# Altium schematic sheet DAC_PLL.SchDoc: RFSoC AMC
size 420 x 297 mm; CompanyName: WUT; DrawnBy: T. Przywozki; Organization: WUT ISE; Address1: Warsaw University of Technology; Address2: Nowowiejska 15/19 00-665 Warsaw; Address3: Tomasz.Przywozki@pw.edu.pl; DocumentNumber: 20; Revision: 1; SheetNumber: 20; SheetTotal: 45; Project: RFSoC AMC; ModifiedBy: T. Przywozki; CreateDate: -; CheckedDate: -; DivGrp: ISE; Designer: T. Przywozki; ModifiedDate: -; ProjectName: ADC/DAC MEZZANINE
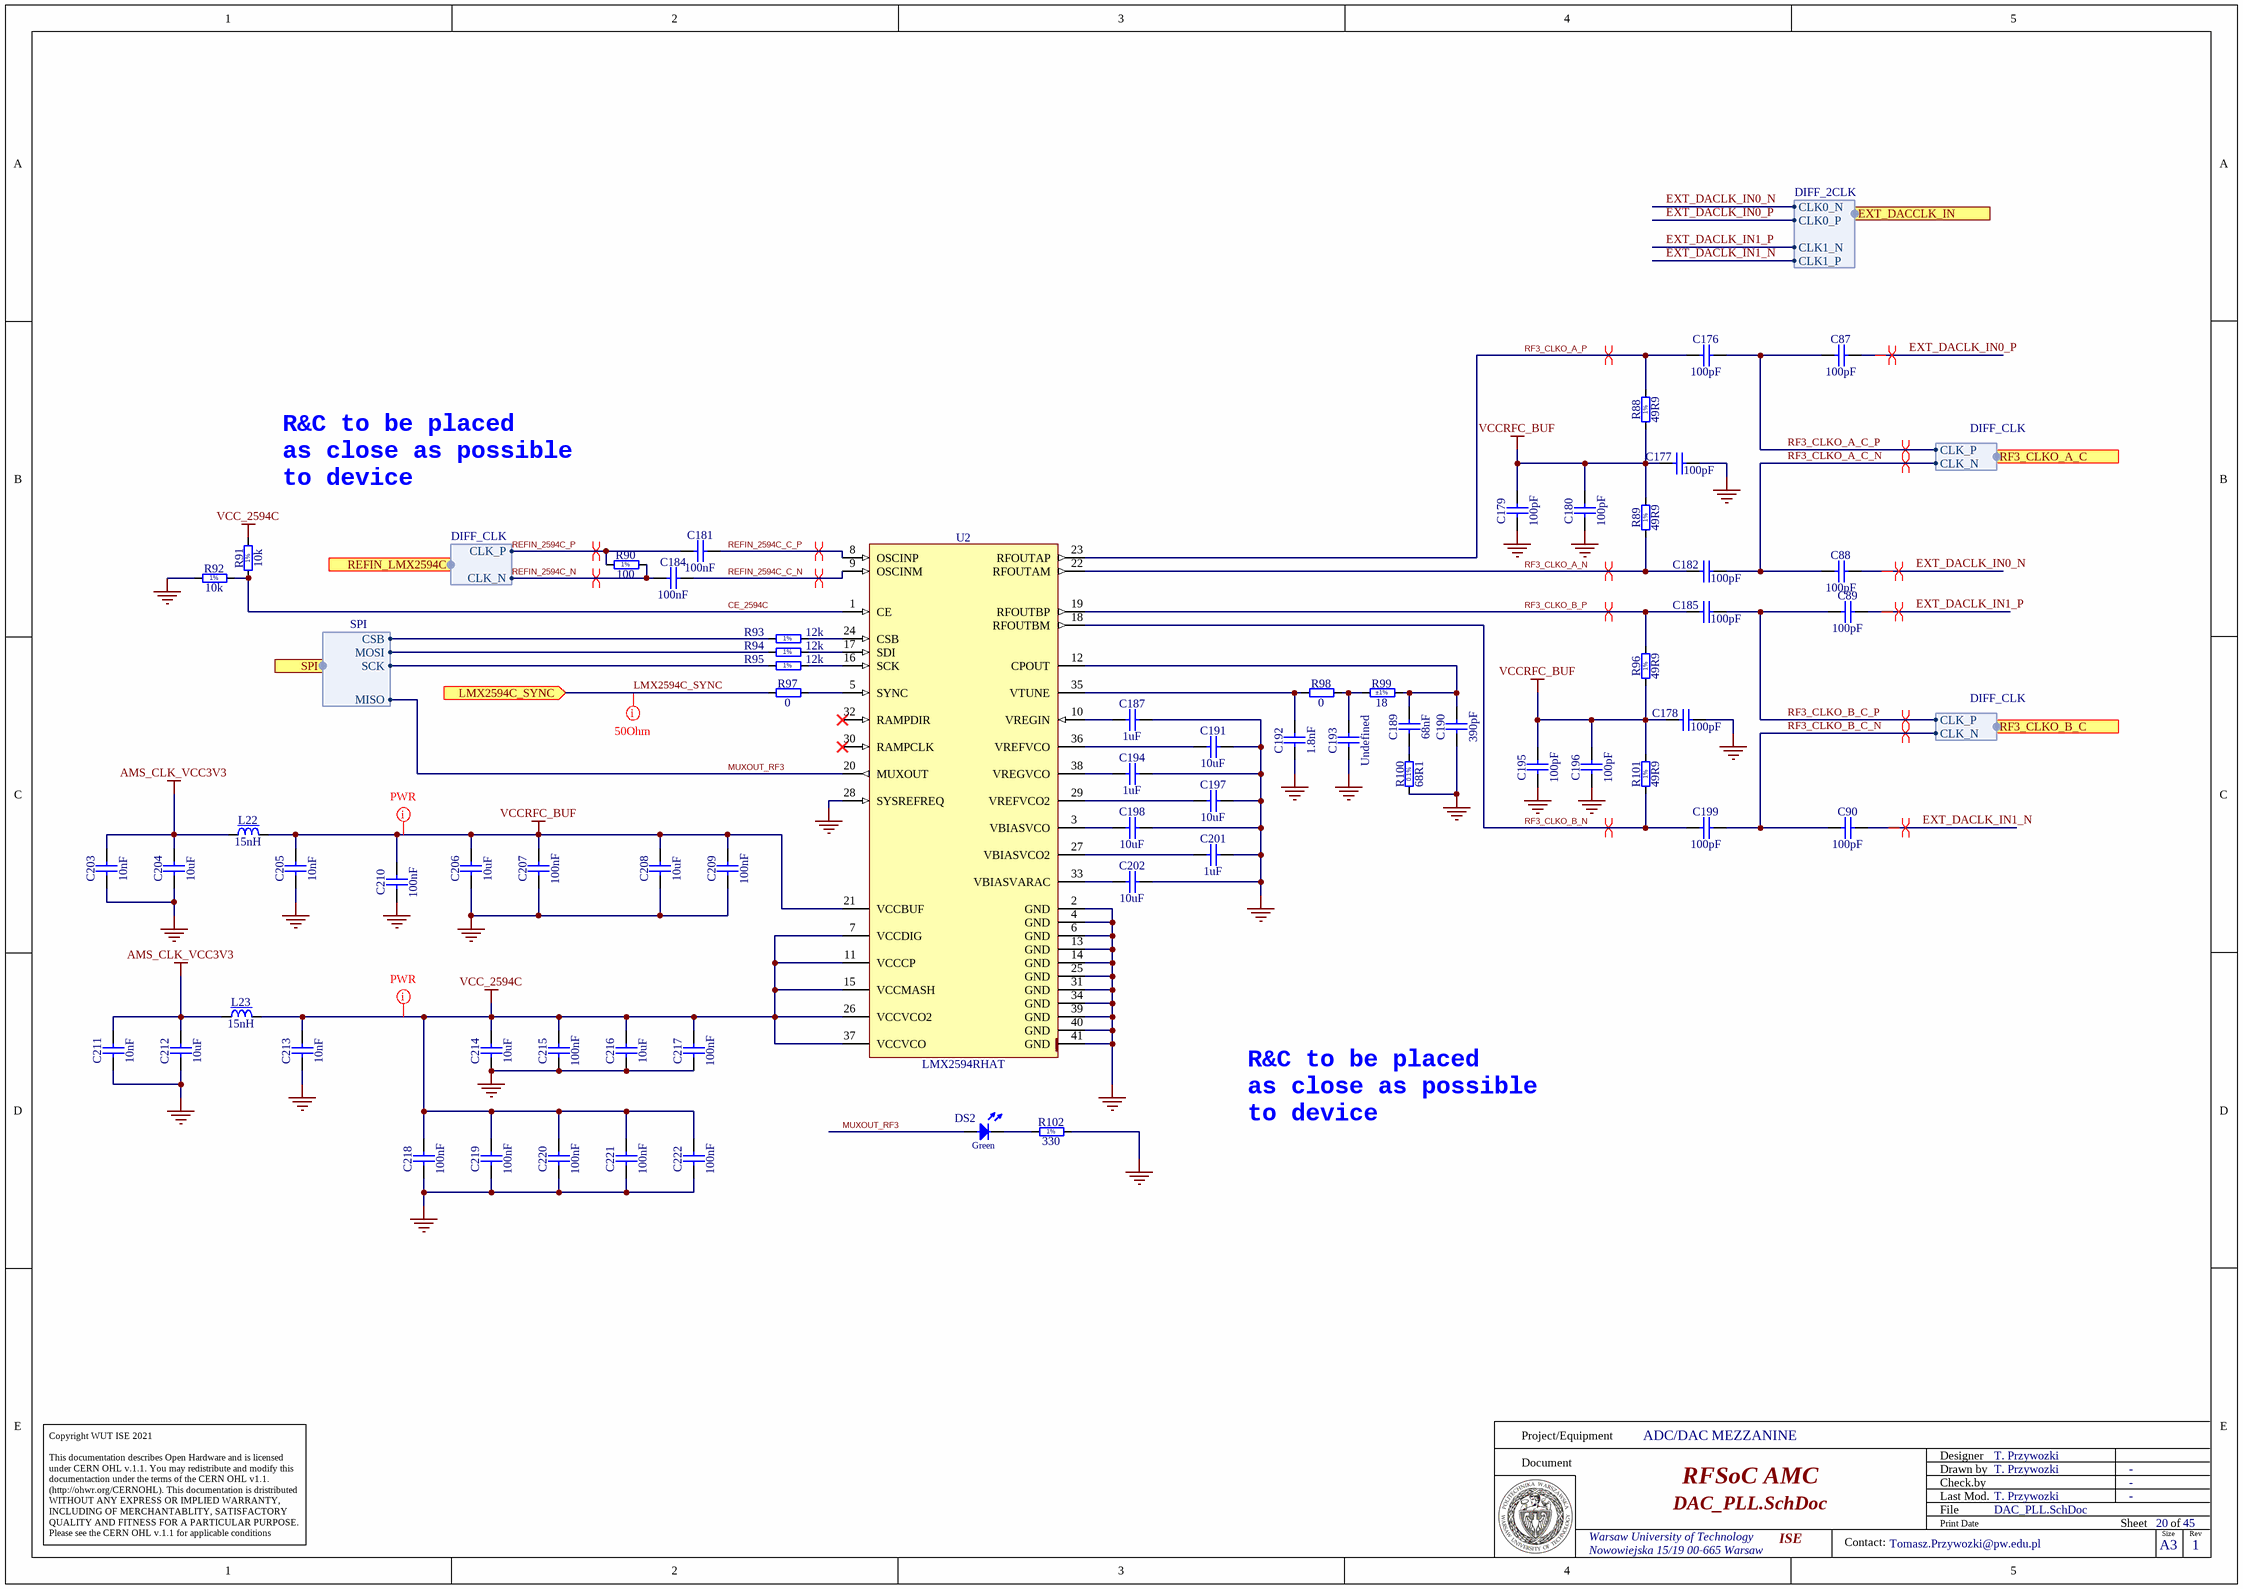
[diagram p0: DAC_PLL.SchDoc]

## Parts
C87  100pF  [CAPC1005X55N]
C88  100pF  [CAPC1005X55N]
C89  100pF  [CAPC1005X55N]
C90  100pF  [CAPC1005X55N]
C176  100pF  [CAPC1005X55N]
C177  100pF  [CAPC1005X55N]
C178  100pF  [CAPC1005X55N]
C179  100pF  [CAPC1005X55N]
C180  100pF  [CAPC1005X55N]
C181  100nF  [CAPC1005X55N]
C182  100pF  [CAPC1005X55N]
C184  100nF  [CAPC1005X55N]
C185  100pF  [CAPC1005X55N]
C187  1uF  [CAPC1005X55N]
C189  68nF  [CAPC1005X55N]
C190  390pF  [CAPC1608X87N]
C191  10uF  [CAPC1608X80N]
C192  1.8nF  [CAPC1608X87N]
C193  Undefined  [CAPC1005X55N]
C194  1uF  [CAPC1005X55N]
C195  100pF  [CAPC1005X55N]
C196  100pF  [CAPC1005X55N]
C197  10uF  [CAPC1608X80N]
C198  10uF  [CAPC1608X80N]
C199  100pF  [CAPC1005X55N]
C201  1uF  [CAPC1005X55N]
C202  10uF  [CAPC1608X80N]
C203  10nF  [CAPC1005X55N]
C204  10uF  [CAPC1608X80N]
C205  10nF  [CAPC1005X55N]
C206  10uF  [CAPC1608X80N]
C207  100nF  [CAPC1005X55N]
C208  10uF  [CAPC1608X80N]
C209  100nF  [CAPC1005X55N]
C210  100nF  [CAPC1005X55N]
C211  10nF  [CAPC1005X55N]
C212  10uF  [CAPC1608X80N]
C213  10nF  [CAPC1005X55N]
C214  10uF  [CAPC1608X80N]
C215  100nF  [CAPC1005X55N]
C216  10uF  [CAPC1608X80N]
C217  100nF  [CAPC1005X55N]
C218  100nF  [CAPC1005X55N]
C219  100nF  [CAPC1005X55N]
C220  100nF  [CAPC1005X55N]
C221  100nF  [CAPC1005X55N]
C222  100nF  [CAPC1005X55N]
DS2  Green  [LED_OSRAM_LGL29K]
L22  15nH  [IND_COILCRAFT_0402DC]
L23  15nH  [IND_COILCRAFT_0402DC]
R88  49R9  [RESC1005X40N]
R89  49R9  [RESC1005X40N]
R90  100  [RESC1005X40N]
R91  10k  [RESC1005X40N]
R92  10k  [RESC1005X40N]
R93  12k  [RESC1005X40N]
R94  12k  [RESC1005X40N]
R95  12k  [RESC1005X40N]
R96  49R9  [RESC1005X40N]
R97  0  [RESC1005X40N]
R98  0  [RESC1005X40N]
R99  18  Tolerance: ±1%  [RESC1005X40N]
R100  68R1  [RESC1608X55N]
R101  49R9  [RESC1005X40N]
R102  330  [RESC1005X40N]
U2  LMX2594RHAT  [QFN50P600X600X100-41N-S460]

## Ports
EXT_DACCLK_IN (harness DIFF_2CLK), LMX2594C_SYNC (in), REFIN_LMX2594C (harness DIFF_CLK), RF3_CLKO_A_C (harness DIFF_CLK), RF3_CLKO_B_C (harness DIFF_CLK), SPI (harness SPI)

## Harnesses
DIFF_CLK: CLK_P, CLK_N
SPI: MOSI, MISO, CSB, SCK
DIFF_2CLK: CLK0_P, CLK0_N, CLK1_P, CLK1_N

## Nets
AMS_CLK_VCC3V3: C203.2 C204.2 C211.2 C212.2 L22.1 L23.1
GND: C177.2 C178.2 C179.1 C180.1 C187.1 C190.1 C191.1 C192.1 C193.1 C194.1 C195.1 C196.1 C197.1 C198.1 C201.1 C202.1 C203.1 C204.1 C205.1 C206.1 C207.1 C208.1 C209.1 C210.1 C211.1 C212.1 C213.1 C214.1 C215.1 C216.1 C217.1 C218.1 C219.1 C220.1 C221.1 C222.1 R92.1 R100.1 R102.2 U2.2(GND) U2.4(GND) U2.6(GND) U2.13(GND) U2.14(GND) U2.25(GND) U2.28(SYSREFREQ) U2.31(GND) U2.34(GND) U2.39(GND) U2.40(GND) U2.41(GND)
VCC_2594C: C213.2 C214.2 C215.2 C216.2 C217.2 C218.2 C219.2 C220.2 C221.2 C222.2 L23.2 R91.2 U2.7(VCCDIG) U2.11(VCCCP) U2.15(VCCMASH) U2.26(VCCVCO2) U2.37(VCCVCO)
VCCRFC_BUF: C177.1 C178.1 C179.2 C180.2 C195.2 C196.2 C205.2 C206.2 C207.2 C208.2 C209.2 C210.2 L22.2 R88.1 R89.2 R96.1 R101.2 U2.21(VCCBUF)
CE_2594C: R91.1 R92.2 U2.1(CE)
EXT_DACLK_IN0_N: C88.2 ; port EXT_DACCLK_IN.CLK0_N
EXT_DACLK_IN0_P: C87.2 ; port EXT_DACCLK_IN.CLK0_P
EXT_DACLK_IN1_N: C90.2 ; port EXT_DACCLK_IN.CLK1_P
EXT_DACLK_IN1_P: C89.2 ; port EXT_DACCLK_IN.CLK1_N
LMX2594C_SYNC: R97.1 ; port LMX2594C_SYNC
MUXOUT_RF3: DS2.2(A) U2.20(MUXOUT) ; port SPI.MISO
REFIN_2594C_C_N: C184.2 U2.9(OSCINM)
REFIN_2594C_C_P: C181.2 U2.8(OSCINP)
REFIN_2594C_N: C184.1 R90.2 ; port REFIN_LMX2594C.CLK_N
REFIN_2594C_P: C181.1 R90.1 ; port REFIN_LMX2594C.CLK_P
RF3_CLKO_A_C_N: C88.1 C182.2 ; port RF3_CLKO_A_C.CLK_N
RF3_CLKO_A_C_P: C87.1 C176.2 ; port RF3_CLKO_A_C.CLK_P
RF3_CLKO_A_N: C182.1 R89.1 U2.22(RFOUTAM)
RF3_CLKO_A_P: C176.1 R88.2 U2.23(RFOUTAP)
RF3_CLKO_B_C_N: C90.1 C199.2 ; port RF3_CLKO_B_C.CLK_N
RF3_CLKO_B_C_P: C89.1 C185.2 ; port RF3_CLKO_B_C.CLK_P
RF3_CLKO_B_N: C199.1 R101.1 U2.18(RFOUTBM)
RF3_CLKO_B_P: C185.1 R96.2 U2.19(RFOUTBP)
NetC187_2: C187.2 U2.10(VREGIN)
NetC189_1: C189.1 R100.2
NetC189_2: C189.2 C190.2 R99.2 U2.12(CPOUT)
NetC191_2: C191.2 U2.36(VREFVCO)
NetC192_2: C192.2 R98.1 U2.35(VTUNE)
NetC193_2: C193.2 R98.2 R99.1
NetC194_2: C194.2 U2.38(VREGVCO)
NetC197_2: C197.2 U2.29(VREFVCO2)
NetC198_2: C198.2 U2.3(VBIASVCO)
NetC201_2: C201.2 U2.27(VBIASVCO2)
NetC202_2: C202.2 U2.33(VBIASVARAC)
NetDS2_1: DS2.1(C) R102.1
NetR93_1: R93.1 U2.24(CSB)
NetR93_2: R93.2 ; port SPI.CSB
NetR94_1: R94.1 U2.17(SDI)
NetR94_2: R94.2 ; port SPI.MOSI
NetR95_1: R95.1 U2.16(SCK)
NetR95_2: R95.2 ; port SPI.SCK
NetR97_2: R97.2 U2.5(SYNC)

Not connected (* = marked no-connect by the designer): U2 30(RAMPCLK)* 32(RAMPDIR)*

## Layout directives
differential pair; differential pair class Diff_100Ohm: EXT_DACLK_IN0_N, EXT_DACLK_IN0_P, EXT_DACLK_IN1_N, EXT_DACLK_IN1_P, REFIN_2594C_C_N, REFIN_2594C_C_P, REFIN_2594C_N, REFIN_2594C_P, RF3_CLKO_A_C_N, RF3_CLKO_A_C_P, RF3_CLKO_A_N, RF3_CLKO_A_P, RF3_CLKO_B_C_N, RF3_CLKO_B_C_P, RF3_CLKO_B_N, RF3_CLKO_B_P
mark named 50Ohm: LMX2594C_SYNC
net class PWR: VCC_2594C, VCCRFC_BUF

## Notes on the sheet
- R&C to be placed
  as close as possible
  to device
- Project/Equipment
- Document
- Designer
- Drawn by
- Check.by
- Copyright WUT ISE 2021
  This documentation describes Open Hardware and is licensed under CERN OHL v.1.1. You may redistribute and modify this documentaction under the terms of the CERN OHL v1.1.
  (http://ohwr.org/CERNOHL). This documentation is dristributed WITHOUT ANY EXPRESS OR IMPLIED WARRANTY, INCLUDING OF MERCHANTABLITY, SATISFACTORY QUALITY AND FITNESS FOR A PARTICULAR PURPOSE. Please see the CERN OHL v.1.1 for applicable conditions
- File
- Last Mod.
- Print Date
- Sheet
- Size
- A3
- of
- Rev
- Contact:
- (in symbol R0402_10K_1%_0.0625W_100PPM) 1%
- (in symbol R0402_12K_1%_0.0625W_100PPM) 1%
- (in symbol R0402_49R9_1%_0.0625W_100PPM) 1%
- (in symbol R0402_100R_1%_0.1W_100PPM) 1%
- (in symbol R0402_330R_1%_0.0625W_100PPM) 1%
- (in symbol R0603_68R1_0.1%_0.063W_10PPM) 0.1%

## Library data of the parts
C87-C90 C176-C180 C182 C185 C195 C196 C199 = CC0402_100PF_25V_5%_C0G_KEMET_HiQ-CBR: Non-polarised capacitor; Part Description: High Q and low ESR, SMD Multilayer Chip Ceramic Capacitor, HiQ-CBR Series; Manufacturer: KEMET; Manufacturer Part Number: CBR04C101J3GAC; Voltage: 25V; TC: C0G/NP0; Tolerance: ±5%; Part Number: CC0402_100PF_25V_5%_C0G_KEMET_HiQ-CBR; Component Kind: Standard; Component Type: Standard; Pin Count: 2; Value: 100pF; Status: Not Recommended; Case: 0402; Mounted: Yes; Socket: No; SMD: Yes; Sense: No; ComponentHeight: 0.55mm; HelpURL: \\cern.ch\dfs\Applications\Altium\Datasheets\CC0402_C0G_KEMET_HiQ-CBR.pdf; Author: CERN DEM MR; CreateDate: 17.11.2017; LatestRevisionDate: 21.11.2017
C181 C184 C207 C209 C210 C215 C217-C222 = CC0402_100NF_25V_10%_X7R_YUDEN_TMK105B7104KVHF: Non-polarised capacitor; Part Description: SMD Multilayer Chip Ceramic Capacitor (High Dielectric Type) for Automotive / Industrial Applications; Manufacturer: TAIYO YUDEN; Voltage: 25V; TC: X7R; Tolerance: ±10%; Part Number: CC0402_100NF_25V_10%_X7R_YUDEN_TMK105B7104KVHF; Component Kind: Standard; Component Type: Standard; Pin Count: 2; Value: 100nF; Status: Not Recommended; Manufacturer Part Number: TMK105B7104KVHF; Case: 0402; Mounted: Yes; Socket: No; SMD: Yes; Sense: No; ComponentHeight: 0.55mm; HelpURL: \\cern.ch\dfs\Applications\Altium\Datasheets\CC0402_TAIYO-YUDEN_TMK105B7104KVHF.pdf; Author: CERN DEM JLC; CreateDate: 10.05.2017; LatestRevisionDate: 10.05.2017
C187 C194 C201 = CC0402_1UF_16V_10%_X5R: Non-polarised capacitor; Part Description: SMD Multilayer Chip Ceramic Capacitor; Manufacturer: GENERIC; Manufacturer1 Part Number: C1005X5R1C105KT; Voltage: 16V; TC: X5R; Tolerance: ±10%; Part Number: CC0402_1UF_16V_10%_X5R; Component Kind: Standard; Component Type: Standard; Pin Count: 2; Value: 1uF; Status: Preferred; Manufacturer Part Number: CC0402_1UF_16V_10%_X5R; Case: 0402; Mounted: Yes; Socket: No; SMD: Yes; Sense: No; Manufacturer1 Example: TDK; Manufacturer1 ComponentHeight: 0.55mm; HelpURL: \\cern.ch\dfs\Applications\Altium\Datasheets\CC0402_X5R_TDK_C.pdf; Author: CERN DEM JLC; CreateDate: 25.10.2012; LatestRevisionDate: 25.10.2012
C189 = CC0402_68NF_16V_10%_X7R: Non-polarised capacitor; Part Description: SMD Multilayer Chip Ceramic Capacitor; Manufacturer: GENERIC; Manufacturer1 Part Number: 223878715647; Voltage: 16V; TC: X7R; Tolerance: ±10%; Part Number: CC0402_68NF_16V_10%_X7R; Component Kind: Standard; Component Type: Standard; Pin Count: 2; Value: 68nF; Status: Not Recommended; Manufacturer Part Number: CC0402_68NF_16V_10%_X7R; Case: 0402; Mounted: Yes; Socket: No; SMD: Yes; Sense: No; Manufacturer1 Example: PHYCOMP; Manufacturer1 ComponentHeight: 0.55mm; HelpURL: \\cern.ch\dfs\Applications\Altium\Datasheets\CC0402_X7R_PHYCOMP.pdf; Author: CERN DEM JLC; CreateDate: 03.12.2007; LatestRevisionDate: 03.12.2007
C190 = CC0603_390PF_50V_5%_NP0: Non-polarised capacitor; Part Description: SMD Multilayer Chip Ceramic Capacitor; Manufacturer: GENERIC; Manufacturer1 Part Number: 223886715391; Voltage: 50V; TC: NP0; Tolerance: ±5%; Part Number: CC0603_390PF_50V_5%_NP0; Component Kind: Standard; Component Type: Standard; Pin Count: 2; Value: 390pF; Status: Preferred; Manufacturer Part Number: CC0603_390PF_50V_5%_NP0; Case: 0603; Mounted: Yes; Socket: No; SMD: Yes; Sense: No; Manufacturer1 Example: PHYCOMP; Manufacturer1 ComponentHeight: 0.87mm; HelpURL: \\cern.ch\dfs\Applications\Altium\Datasheets\CC0603_NP0_PHYCOMP.pdf; Author: CERN DEM JLC; CreateDate: 03.12.2007; LatestRevisionDate: 03.12.2007
C191 C197 C198 C202 C204 C206 C208 C212 C214 C216 = CC0603_10UF_10V_10%_X5R: Non-polarised capacitor; Part Description: SMD Multilayer Chip Ceramic Capacitor; Manufacturer: GENERIC; Manufacturer1 Part Number: GRM188R61A106KE69D; Voltage: 10V; TC: X5R; Tolerance: ±10%; Part Number: CC0603_10UF_10V_10%_X5R; Component Kind: Standard; Component Type: Standard; Pin Count: 2; Value: 10uF; Status: None; Manufacturer Part Number: CC0603_10UF_10V_10%_X5R; Case: 0603; Mounted: Yes; Socket: No; SMD: Yes; Sense: No; Manufacturer1 Example: MURATA; Manufacturer1 ComponentHeight: 0.8mm; HelpURL: \\cern.ch\dfs\Applications\Altium\Datasheets\CC0603_MURATA_GRM188R61A106KE69D.pdf; Author: CERN DEM JLC; CreateDate: 31.01.2017; LatestRevisionDate: 31.01.2017
C192 = CC0603_1.8NF_50V_5%_X7R: Non-polarised capacitor; Part Description: SMD Multilayer Chip Ceramic Capacitor; Manufacturer: GENERIC; Manufacturer1 Part Number: C0603C182J5RACTU; Voltage: 50V; TC: X7R; Tolerance: ±5%; Part Number: CC0603_1.8NF_50V_5%_X7R; Component Kind: Standard; Component Type: Standard; Pin Count: 2; Value: 1.8nF; Status: Preferred; Manufacturer Part Number: CC0603_1.8NF_50V_5%_X7R; Case: 0603; Mounted: Yes; Socket: No; SMD: Yes; Sense: No; Manufacturer1 Example: KEMET; Manufacturer1 ComponentHeight: 0.87mm; HelpURL: \\cern.ch\dfs\Applications\Altium\Datasheets\CC0603_X7R_KEMET.pdf; Author: CERN DEM JLC; CreateDate: 31.05.2018; LatestRevisionDate: 31.05.2018
C193 = CC0402_NO-VALUE: Non-polarised capacitor; Part Description: Reserved Footprint For 0402(1005) Chip Ceramic Capacitor; Mounted: No; Part Number: CC0402_NO-VALUE; Component Kind: Standard; Component Type: Standard; Pin Count: 2; Value: Undefined; Status: None; Manufacturer: Undefined; Manufacturer Part Number: CC0402_NO-VALUE; Case: 0402; Socket: No; SMD: Yes; Sense: No; Manufacturer1 ComponentHeight: 0.55mm; HelpURL: Undefined; Author: CERN DEM JLC; CreateDate: 14.01.2014; LatestRevisionDate: 14.01.2014
C203 C205 C211 C213 = CC0402_10NF_16V_10%_X7R: Non-polarised capacitor; Part Description: SMD Multilayer Chip Ceramic Capacitor; Manufacturer: GENERIC; Manufacturer1 Part Number: 223878715636; Voltage: 16V; TC: X7R; Tolerance: ±10%; Part Number: CC0402_10NF_16V_10%_X7R; Component Kind: Standard; Component Type: Standard; Pin Count: 2; Value: 10nF; Status: Not Recommended; Manufacturer Part Number: CC0402_10NF_16V_10%_X7R; Case: 0402; Mounted: Yes; Socket: No; SMD: Yes; Sense: No; Manufacturer1 Example: PHYCOMP; Manufacturer1 ComponentHeight: 0.55mm; HelpURL: \\cern.ch\dfs\Applications\Altium\Datasheets\CC0402_X7R_PHYCOMP.pdf; Author: CERN DEM JLC; CreateDate: 03.12.2007; LatestRevisionDate: 03.12.2007
DS2 = LED_OSRAM_LG L29K-G2J1-24-Z: LED Green 1C 2A; Part Description: Surface Mount Green LED (0603 Case); Manufacturer: OSRAM; PressFit: No; Bonding: No; Status Comment: Sourcing Difficulty; Part Number: LED_OSRAM_LG L29K-G2J1-24-Z; Component Kind: Standard; Component Type: Standard; Color: Green; PackageDescription: Green Chip LED, 2-Leads, Body 1.7x0.8mm, IPC Medium Density; Status: Not Recommended; Manufacturer Part Number: LG L29K-G2J1-24-Z; Pin Count: 2; Case: 0603; Mounted: Yes; Socket: No; SMD: Yes; Sense: No; ComponentHeight: 0.67mm; HelpURL: \\cern.ch\dfs\Applications\Altium\Datasheets\LED_OSRAM_LGL29K.pdf; Author: CERN DEM JLC; CreateDate: 24.04.2012; LatestRevisionDate: 24.04.2012
L22 L23 = IND0402_15NH_2%_COILCRAFT_0402DC: Inductor With Core; Part Description: Ceramic Wirewound Chip Inductor, 0402DC Series; Manufacturer Part Number: 0402DC-15NXGRW; Power: 1A; Resistance: 0.115R; Tolerance: ±2%; Part Number: IND0402_15NH_2%_COILCRAFT_0402DC; Component Kind: Standard; Component Type: Standard; Pin Count: 2; Value: 15nH; Status: None; Manufacturer: COILCRAFT; Case: 0402; Mounted: Yes; Socket: No; SMD: Yes; Sense: No; ComponentHeight: 0.61mm; HelpURL: \\cern.ch\dfs\Applications\Altium\Datasheets\IND0402_COILCRAFT_0402DC.pdf; Author: CERN DEM JLC; CreateDate: 04.12.2018; LatestRevisionDate: 04.12.2018
R88 R89 R96 R101 = R0402_49R9_1%_0.0625W_100PPM: Resistor - 1%; Part Description: General Purpose Thick Film Chip Resistor; Manufacturer: GENERIC; Manufacturer1 Part Number: 232270674999L or RC0402FR-0749R9L; TC: ±100ppm/°C; PressFit: No; Part Number: R0402_49R9_1%_0.0625W_100PPM; Component Kind: Standard; Component Type: Standard; Pin Count: 2; Value: 49R9; Status: Not Recommended; Power: 0.0625W; Tolerance: ±1%; Manufacturer Part Number: R0402_49R9_1%_0.0625W_100PPM; Case: 0402; Mounted: Yes; Sense: No; Socket: No; SMD: Yes; Manufacturer1 Example: YAGEO PHYCOMP; Manufacturer1 ComponentHeight: 0.4mm; HelpURL: \\cern.ch\dfs\Applications\Altium\Datasheets\R0402_Phycomp_RC0402.pdf; Author: CERN DEM JLC; CreateDate: 24.10.2012; LatestRevisionDate: 24.10.2012
R90 = R0402_100R_1%_0.1W_100PPM: Resistor - 1%; Part Description: General Purpose Thick Film Chip Resistor; Manufacturer: GENERIC; Manufacturer Part Number: R0402_100R_1%_0.1W_100PPM_50V; Manufacturer1 Part Number: ERJ2RKF1000X; Power: 0.1W; TC: ±100ppm/°C; Voltage: 50V; PressFit: No; Part Number: R0402_100R_1%_0.1W_100PPM; Component Kind: Standard; Component Type: Standard; Pin Count: 2; Value: 100; Status: Not Recommended; Tolerance: ±1%; Case: 0402; Mounted: Yes; Sense: No; Socket: No; SMD: Yes; Manufacturer1 Example: PANASONIC; Manufacturer1 ComponentHeight: 0.4mm; HelpURL: \\cern.ch\dfs\Applications\Altium\Datasheets\R0402_PANASONIC_ERJ2RK.pdf; Author: CERN DEM JLC; CreateDate: 12.12.2013; LatestRevisionDate: 03.03.2015
R91 R92 = R0402_10K_1%_0.0625W_100PPM: Resistor - 1%; Part Description: General Purpose Thick Film Chip Resistor; Manufacturer: GENERIC; Manufacturer1 Part Number: 232270671003L; TC: ±100ppm/°C; PressFit: No; Part Number: R0402_10K_1%_0.0625W_100PPM; Component Kind: Standard; Component Type: Standard; Pin Count: 2; Value: 10k; Status: Not Recommended; Power: 0.0625W; Tolerance: ±1%; Manufacturer Part Number: R0402_10K_1%_0.0625W_100PPM; Case: 0402; Mounted: Yes; Sense: No; Socket: No; SMD: Yes; Manufacturer1 Example: YAGEO PHYCOMP; Manufacturer1 ComponentHeight: 0.4mm; HelpURL: \\cern.ch\dfs\Applications\Altium\Datasheets\R0402_Phycomp_RC0402.pdf; Author: CERN DEM JLC; CreateDate: 03.12.2007; LatestRevisionDate: 17.10.2012
R93-R95 = R0402_12K_1%_0.0625W_100PPM: Resistor - 1%; Part Description: General Purpose Thick Film Chip Resistor; Manufacturer: GENERIC; Manufacturer1 Part Number: 232270671203L; TC: ±100ppm/°C; PressFit: No; Part Number: R0402_12K_1%_0.0625W_100PPM; Component Kind: Standard; Component Type: Standard; Pin Count: 2; Value: 12k; Status: Not Recommended; Power: 0.0625W; Tolerance: ±1%; Manufacturer Part Number: R0402_12K_1%_0.0625W_100PPM; Case: 0402; Mounted: Yes; Sense: No; Socket: No; SMD: Yes; Manufacturer1 Example: YAGEO PHYCOMP; Manufacturer1 ComponentHeight: 0.4mm; HelpURL: \\cern.ch\dfs\Applications\Altium\Datasheets\R0402_Phycomp_RC0402.pdf; Author: CERN DEM JLC; CreateDate: 03.12.2007; LatestRevisionDate: 17.10.2012
R97 R98 = R0402_0R_JUMPER: Resistor; Part Description: 1A (0.05R Max DC Resistance) Zero Ohm Jumper; Manufacturer: GENERIC; Manufacturer1 Part Number: 232270591001L; PressFit: No; Part Number: R0402_0R_JUMPER; Component Kind: Standard; Component Type: Standard; Pin Count: 2; Value: 0; Status: Not Recommended; Manufacturer Part Number: R0402_0R_JUMPER; Case: 0402; Mounted: Yes; Sense: No; Socket: No; SMD: Yes; Manufacturer1 Example: YAGEO PHYCOMP; Manufacturer1 ComponentHeight: 0.4mm; HelpURL: \\cern.ch\dfs\Applications\Altium\Datasheets\R0402_Phycomp_RC0402.pdf; Author: CERN DEM JLC; CreateDate: 03.12.2007; LatestRevisionDate: 17.10.2012
R99 = R0402_18R_1%_0.0625W_100PPM: Resistor - 1%; Part Description: General Purpose Thick Film Chip Resistor; Manufacturer: GENERIC; Manufacturer1 Part Number: 232270671809L; TC: ±100ppm/°C; PressFit: No; Part Number: R0402_18R_1%_0.0625W_100PPM; Component Kind: Standard; Component Type: Standard; Pin Count: 2; Value: 18; Status: Not Recommended; Power: 0.0625W; Manufacturer Part Number: R0402_18R_1%_0.0625W_100PPM; Case: 0402; Mounted: Yes; Sense: No; Socket: No; SMD: Yes; Manufacturer1 Example: YAGEO PHYCOMP; Manufacturer1 ComponentHeight: 0.4mm; HelpURL: \\cern.ch\dfs\Applications\Altium\Datasheets\R0402_Phycomp_RC0402.pdf; Author: CERN DEM JLC; CreateDate: 03.12.2007; LatestRevisionDate: 17.10.2012
R100 = R0603_68R1_0.1%_0.063W_10PPM: Resistor - 0.1%; Part Description: Thin Film Chip Resistor; Manufacturer: GENERIC; Manufacturer1 Part Number: RN73C1J68R1BTDF; Power: 0.063W; TC: ±10ppm; PressFit: No; Part Number: R0603_68R1_0.1%_0.063W_10PPM; Component Kind: Standard; Component Type: Standard; Pin Count: 2; Value: 68R1; Status: Not Recommended; Tolerance: ±0.1%; Manufacturer Part Number: R0603_68R1_0.1%_0.063W_10PPM; Case: 0603; Mounted: Yes; Sense: No; Socket: No; SMD: Yes; Manufacturer1 Example: TYCO HOLSWORTHY; Manufacturer1 ComponentHeight: 0.5mm; HelpURL: \\cern.ch\dfs\Applications\Altium\Datasheets\R0603_Tyco_RN73.pdf; Author: CERN DEM JLC; CreateDate: 03.12.2007; LatestRevisionDate: 13.03.2008
R102 = R0402_330R_1%_0.0625W_100PPM: Resistor - 1%; Part Description: General Purpose Thick Film Chip Resistor; Manufacturer: GENERIC; Manufacturer1 Part Number: 232270673301L; TC: ±100ppm/°C; PressFit: No; Tolerance: ±1%; Power: 0.0625W; Part Number: R0402_330R_1%_0.0625W_100PPM; Component Kind: Standard; Component Type: Standard; Pin Count: 2; Value: 330; Status: Not Recommended; Manufacturer Part Number: R0402_330R_1%_0.0625W_100PPM; Case: 0402; Mounted: Yes; Sense: No; Socket: No; SMD: Yes; Manufacturer1 Example: YAGEO PHYCOMP; Manufacturer1 ComponentHeight: 0.4mm; HelpURL: \\cern.ch\dfs\Applications\Altium\Datasheets\R0402_Phycomp_RC0402.pdf; Author: CERN DEM JLC; CreateDate: 03.12.2007; LatestRevisionDate: 17.10.2012
U2 = LMX2594RHAT: 15GHz Wideband PLLatinum RF Synthesizer with Phase Synchronization and JESD204B Support; Manufacturer: TEXAS INSTRUMENTS; PressFit: No; Bonding: No; Part Number: LMX2594RHAT; Component Kind: Standard; Component Type: Standard; Device: LMX2594RHAT; PackageDescription: QFN, 0.50mm Pitch, Square; 40 pin, 6.00mm L X 6.00mm W X 1.00mm H body (W/Thermal Tab 4.60mm x 4.60mm), IPC Medium Density; Part Description: 15GHz Wideband PLLatinum RF Synthesizer with Phase Synchronization and JESD204B Support; Manufacturer Part Number: LMX2594RHAT; Pin Count: 41; Case: QFN40; Mounted: Yes; Socket: No; SMD: Yes; Sense: No; ComponentHeight: 1mm; Author: CERN DEM JLC; HelpURL: \\cern.ch\dfs\Applications\Altium\Datasheets\LMX2594RHAT.pdf; CreateDate: 04.12.2018; LatestRevisionDate: 04.12.2018